# Altium project Pinger.PrjPcb
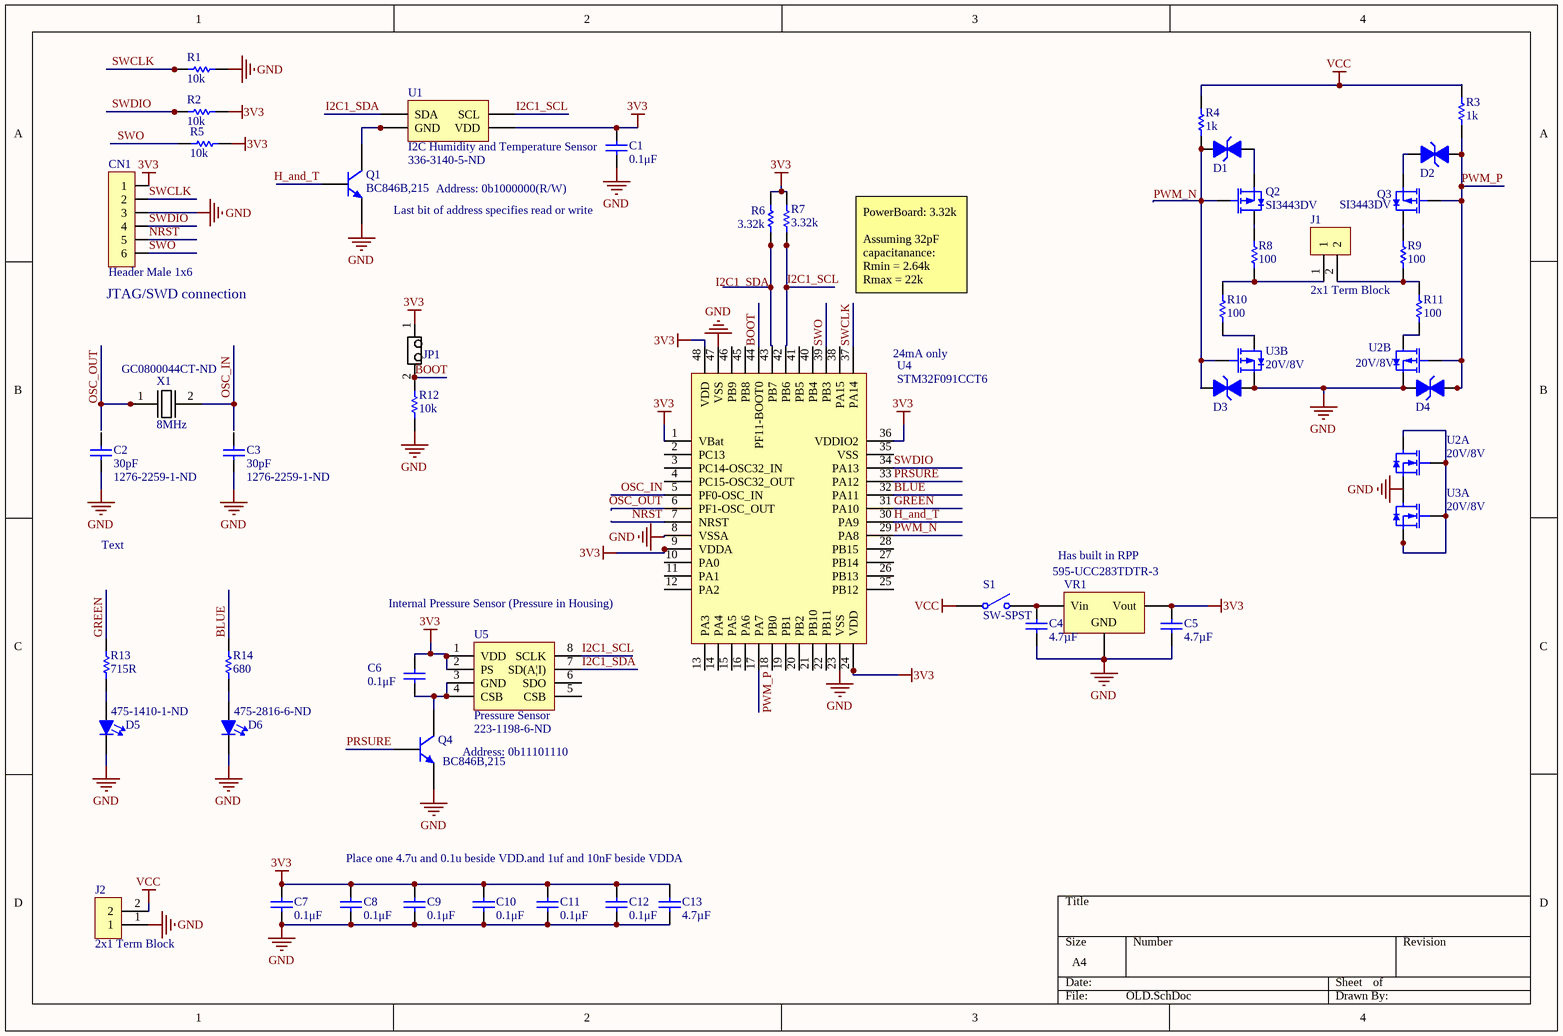
[diagram p0: OLD.SchDoc]
2 sheets, 106 parts. Net scope: global (net labels, ports and power ports of the same name join across sheets).
Board file: OLD.PcbDoc
Sheets:
  OLD.SchDoc
  main.SchDoc

## Sheet OLD.SchDoc: Pinger
size A4; Date: 05/06/2020; CompanyName: AUVIC; DrawnBy: Aman Nijjar; Engineer: Aman Nijjar; Organization: AUVIC; DocumentNumber: 1; Revision: 3; SheetNumber: 1; SheetTotal: 1

### Parts
C1  0.1μF  [CAPC1608N(0603")]
C2  30pF  Supplier Part Number 1: 1276-2259-1-ND  [CAPC1608N(0603")]
C3  30pF  Supplier Part Number 1: 1276-2259-1-ND  [CAPC1608N(0603")]
C4  4.7µF  [CAPC2012N(0805")]
C5  4.7µF  [CAPC2012N(0805")]
C6  0.1μF  [CAPC1608N(0603")]
C7  0.1μF  [CAPC1608N(0603")]
C8  0.1μF  [CAPC1608N(0603")]
C9  0.1μF  [CAPC1608N(0603")]
C10  0.1μF  [CAPC1608N(0603")]
C11  0.1μF  [CAPC1608N(0603")]
C12  0.1μF  [CAPC1608N(0603")]
C13  4.7µF  [CAPC2012N(0805")]
CN1  Header Male 1x6  [Header, Male, 1X6]
D1  SMBJ24CA  [DO-214AC]  (value not drawn)
D2  SMBJ24CA  [DO-214AC]  (value not drawn)
D3  SMBJ24CA  [DO-214AC]  (value not drawn)
D4  SMBJ24CA  [DO-214AC]  (value not drawn)
D5  Supplier Part Number 1: 475-1410-1-ND  [LED0805]  (hidden comment: Red)
D6  Supplier Part Number 1: 475-2816-6-ND  [LED0603]  (hidden comment: Blue)
J1  2x1 Term Block  [2X1 Terminal Blocks Phoenix Contact 5mm]
J2  2x1 Term Block  [2X1 Terminal Blocks]
JP1  1X2 Pin Head  [2X1 Males Header]  (value not drawn)
Q1  BC846B,215  [SOT-23]
Q2  SI3443DV  [SuperSOT-6]
Q3  SI3443DV  [SuperSOT-6]
Q4  BC846B,215  [SOT-23]
R1  10k  [RESC1608N(0603")]
R2  10k  [RESC1608N(0603")]
R3  1k  [RESC1608N(0603")]
R4  1k  [RESC1608N(0603")]
R5  10k  [RESC1608N(0603")]
R6  3.32k  [RESC1608N(0603")]
R7  3.32k  [RESC1608N(0603")]
R8  100  [RESC1608N(0603")]
R9  100  [RESC1608N(0603")]
R10  100  [RESC1608N(0603")]
R11  100  [RESC1608N(0603")]
R12  10k  [RESC1608N(0603")]
R13  715R  [RESC1608N(0603")]
R14  680  [RESC2012N(0805")]
S1  SW-SPST  [SPST-2]
U1  I2C Humidity and Temperature Sensor  Supplier Part Number 1: 336-3140-5-ND  [QFN-6]
U2  20V/8V  [SOT-363]  (parts A,B of 2)
U3  20V/8V  [SOT-363]  (parts A,B of 2)
U4  STM32F091CCT6  [STM-48LQFP]
U5  Pressure Sensor  Supplier Part Number 1: 223-1198-6-ND  [TE Pressure Sensor (MS560702BA03-50)]
VR1  595-UCC283TDTR-3  [D2PAK_N]
X1  8MHz  Supplier Part Number 1: GC0800044CT-ND  [HC49/US]

### Nets
3V3: C1.1(Anode) C1.2(Cathode) C2.1 C3.1 C4.1(Anode) C5.1(Anode) C5.2(Cathode) C6.2(Cathode) C7.1(Anode) C7.2(Cathode) C8.1(Anode) C8.2(Cathode) C9.1(Anode) C9.2(Cathode) C10.1(Anode) C10.2(Cathode) C11.1(Anode) C11.2(Cathode) C12.1(Anode) C12.2(Cathode) C13.1(Anode) C13.2(Cathode) CN1.1 CN1.3 D3.2(Cathode) D4.2(Cathode) D5.1(Cathode) D6.1(Cathode) J2.1 JP1.1 Q1.2(E) Q4.2(E) R1.1 R2.2 R5.2 R6.1 R7.1 R12.1 U1.5(VDD) U2.4(S2) U3.4(S2) U3.6(D1) U4.1(VBat) U4.8(VSSA) U4.9(VDDA) U4.23(VSS) U4.24(VDD) U4.36(VDDIO2) U4.47(VSS) U4.48(VDD) U5.1(VDD) U5.2(PS) VR1.2(GND) VR1.3(Vout)  [also labelled GND]
VCC: J2.2 R3.2 R4.2 S1.1(COMMON)
BLUE: R14.2 U4.32(PA11)
BOOT: JP1.2 R12.2 U4.44(PF11-BOOT0)
GREEN: R13.2 U4.31(PA10)
H_and_T: Q1.1(B) U4.30(PA9)
I2C1_SCL: R7.2 U1.6(SCL) U4.42(PB6) U5.8(SCLK)
I2C1_SDA: R6.2 U1.1(SDA) U4.43(PB7) U5.7(SD(A|I))
NRST: CN1.5 U4.7(NRST)
OSC_IN: U4.5(PF0-OSC_IN) X1.2
OSC_OUT: U4.6(PF1-OSC_OUT) X1.1
PRSURE: Q4.1(B) U4.33(PA12)
PWM_N: D1.2(Cathode) D3.1(Anode) Q2.3 R4.1 U3.5(G2) U4.29(PA8)
PWM_P: D2.2(Cathode) D4.1(Anode) Q3.3 R3.1 U2.5(G2) U4.17(PA7)
SWCLK: CN1.2 R1.2 U4.37(PA14)
SWDIO: CN1.4 R2.1 U4.34(PA13)
SWO: CN1.6 R5.1 U4.39(PB3)
NetC4_2: C4.2(Cathode) S1.2(NO) VR1.1(Vin)
NetC6_1: C6.1(Anode) Q4.3(C) U5.3(GND) U5.4(CSB)
NetD1_1: D1.1(Anode) Q2.1
NetD2_1: D2.1(Anode) Q3.1
NetD5_2: D5.2(Anode) R13.1
NetD6_2: D6.2(Anode) R14.1
NetJ1_1: J1.1 R8.1 R10.2
NetJ1_2: J1.2 R9.1 R11.2
NetQ1_3: Q1.3(C) U1.2(GND)
NetQ2_4: Q2.4 R8.2
NetQ3_4: Q3.4 R9.2
NetR10_1: R10.1 U3.3(D2)
NetR11_1: R11.1 U2.3(D2)
NetU2_2: U2.2(G1) U2.6(D1) U3.1(S1) U3.2(G1)

Not connected (* = marked no-connect by the designer): C2 2; C3 2; U2 1(S1); U4 2(PC13) 3(PC14-OSC32_IN) 4(PC15-OSC32_OUT) 10(PA0) 11(PA1) 12(PA2) 13(PA3) 14(PA4) 15(PA5) 16(PA6) 18(PB0) 19(PB1) 20(PB2) 21(PB10) 22(PB11) 25(PB12) 26(PB13) 27(PB14) 28(PB15) 35(VSS) 38(PA15) 40(PB4) 41(PB5) 45(PB8) 46(PB9); U5 5(CSB) 6(SDO)

### Notes on the sheet
- Last bit of address specifies read or write
- Address: 0b1000000(R/W)
- (near CN1) JTAG/SWD connection
- PowerBoard: 3.32k
  Assuming 32pF capacitanance:
  Rmin = 2.64k
  Rmax = 22k
- (near U4) 24mA only
- Text
- Has built in RPP
- (near U4) Internal Pressure Sensor (Pressure in Housing)
- (near Q4) Address: 0b11101110
- Place one 4.7u and 0.1u beside VDD.and 1uf and 10nF beside VDDA

### Library data of the parts
C1 C6-C12 = 0.1uF 100V 0603 SMD, Ceramic: Capacitor, Ceramic, 100V, +/- 10%, 0603 SMD, X7R; MFG: TDK; MFG#: CGA3E3X7S2A104K080AB; Published: 16-04-26; Publisher: AUVic; PackageDescription: Chip Capacitor; Value: 0.1μF; Created By: Ashwin Sira; Supplier 1: Digi-Key; Supplier Part Number 1: 445-6938-1-ND
C2 C3 = 30pF 50V 0603 SMD, Ceramic: Capacitor, Ceramic, 50V, +/-1%, 0603 SMD, C0G; Made By: Andy Bates; Published: 16-09-12; Publisher: AUVic; PackageDescription: Chip Capacitor; Value: 30pF; Supplier 1: Digi-Key
C4 C5 C13 = 4.7uF 35V 0805 SMD, Ceramic: Capacitor, Ceramic, 35V, +/- 10%, 0805 SMD, X5R; Made By: Andy Bates; Published: 16-11-12; Publisher: AUVic; PackageDescription: Chip Capacitor; Value: 4.7µF; Supplier 1: Digi-Key; Supplier Part Number 1: 1276-6722-1-ND
CN1 = Header, Male, 1x6: 1x6, Pads Pitch: 0.1" (2.54mm), Through hole; Made Bates: Andy Bates; Supplier 1: Digikey; Supplier 1 Part Number: 952-2270-ND
D1-D4 = SMBJ24CA: TVS DIODE 24VWM 38.9VC SMB; Manufacturer: Fairchild Semiconductor; Type: Zener; Bidirectional Channels: 1; Voltage - Reverse Standoff (Typ): 24V; Voltage - Breakdown (Min): 26.7V; Voltage - Clamping (Max) @ Ipp: 38.9V; Current - Peak Pulse (10/1000µs): 15.4A; Power - Peak Pulse: 600W; Power Line Protection: No; Supplier 1: Digi-Key; Manufacturer Part Number: SMBJ24CA; RoHS: RoHS Compliant; Category: Circuit Protection; Stock 1: 31873; Pricing 1: 1=0.58, 10=0.411, 25=0.3372, 100=0.2695, 250=0.19636, 500=0.15946, 1000=0.12257 (USD); Packaging: Cut Tape (CT); Unidirectional Channels: -; Applications: General Purpose; Capacitance @ Frequency: -; Operating Temperature: -55°C ~ 150°C (TJ); Mounting Type: Surface Mount; Package / Case: DO-214AA, SMB; Supplier Device Package: DO-214AA (SMB); ComponentLink1URL: http://www.fairchildsemi.com/datasheets/SM/SMBJ100A.pdf; ComponentLink1Description: http://www.fairchildsemi.com/datasheets/SM/SMBJ100A.pdf; Supplier Part Number 1: SMBJ24CAFSCT-ND
D5 = LED, 0805 (2012), Green, Clear: Colour: Red; Created By: Andy Bates; Supplier 1: Digi-Key
D6 = LED, 0603 (1608), Blue, Clear: Colour: Blue; Created By: Lyden Smith; Date Created: 2017-09-19; Supplier 1: Digi-Key
J1 = 2x1 Terminal Block, 20A, 12-20AWG: Made by: Andy Bates; Date Made: 2017-11-14; Supplier 1: Digi-Key; Supplier Part Number 1: 277-6405-ND
J2 = 2x1 Terminal Block: Made by: Andy Bates; Supplier 1: Digikey; Supplier Part Number 1: ED2740-ND
JP1 = 1x2 Male Header: Made By: Andy Bates; Supplier 1: Digikey; Supplier Part Number 1: 952-3073-ND
Q1 Q4 = BC846B,215: NPN 65V 100mA 250mW; Published: 8-Jun-2000; LatestRevisionDate: 09-Sep-2016; DatasheetVersion: 1997; Publisher: Andy Bates; Supplier 1: Digi-Key; Supplier Part Number 1: 568-1632-1-ND
Q2 Q3 = SI3443DVFSTR-ND: P-Channel 20V 4A (Ta) 1.6W (Ta) Surface Mount SuperSOT™-6; ComponentLink1Description: Datasheet; ComponentLink1URL: *https://www.onsemi.com/pub/Collateral/SI3443DV-D.PDF; Supplier 1: Digi-Key
R1 R2 R5 R12 = 10kR, 1%, 1/10W, 0603 SMD: Made By: Ashwin Sira; Owned By: AUVic; Created On: 14-05-31; Last Edited: 14-05-31; Supplier 1: Digi-Key; Supplier Part Number 1: 311-10.0KHRCT-ND; Value: 10k
R3 R4 = 1kR, 1%, 1/10W , 0603, SMD: Created By: Andy Bates; Publisher: AUVic; Date Created: 2017-05-10; Value: 1k; Supplier 1: Digikey; Supplier Part Number 1: 311-1.00KHRCT-ND
R6 R7 = 3.32k, 1%, 1/10W, 0603, SMD: Created By: Ashwin Sira; Publisher: AUVic; Date Created: 2016-06-25; Value: 3.32k; Supplier 1: Digi-Key; Supplier Part Number 1: RMCF0603FT3K32CT-ND
R8-R11 = 100R, 1%, 1/10W, 0603 SMD: Made By: Andy Bates; Owned By: AUVic; Created On: 16-09-10; Last Edited: 16-09-10; Value: 100; Supplier 1: Digi-Key; Supplier Part Number 1: 311-100HRCT-ND
R13 = 715R, 1%, 1/10W, 0603, SMD: Created By: Ashwin Sira; Publisher: AUVic; Date Created: 2016-06-10; Value: 715R; Supplier 1: Digi-Key; Supplier Part Number 1: 541-715HCT-ND
R14 = 680, 5%, 1/8W, 0805 SMD: Value: 680; Created By: Lyden Smith; Created On: 2017-06-04; Supplier 1: Digi-Key; Supplier Part Number 1: RMCF0805JT680RCT-ND
S1 = SW-SPST: Single-Pole, Single-Throw Switch; Published: 24-Mar-1999; LatestRevisionDate: 17-Jul-2002; LatestRevisionNote: Re-released for DXP Platform.; PackageReference: SPST-2; Publisher: Altium Limited; PackageDescription: Switch; 2 Leads
U1 = Si700XX: Made by: Andy Bates; Supplier 1: Digi-Key; Created on: 2019/09/08
U2 U3 = NTJD4105CT1GOSTR-ND: Mosfet Array N and P-Channel 20V, 8V 630mA, 775mA 270mW Surface Mount SC-88/SC70-6/SOT-363; Supplier 1: Digi-Key; Supplier Part Number 1: NTJD4105CT1GOSCT-ND; ComponentLink1Description: Datasheet; ComponentLink1URL: https://www.onsemi.com/pub/Collateral/NTJD4105C-D.PDF
U4 = STM32F091CCT6: LQFP48 Chip; Made by: Andy Bates; Digikey Number: 497-15166-ND; Supplier 1: Digikey
U5 = MS560702BA03-50 Pressure Sensor: 1kPa to 120 kPa; Made by: Andy Bates; Created on: 2017-09-11; Supplier 1: Digi-Key
VR1 = Volt Reg: Voltage Regulator; Published: 24-Mar-1999; LatestRevisionDate: 29-May-2009; LatestRevisionNote: IPC-7351 Footprint Added.; PackageReference: D2PAK; Publisher: Altium Limited; PackageDescription: 3-Pin Transistor Outline Package 2.54 mm Pitch, 15.1 mm Lead Span
X1 = Oscillator 8MHz 40ESR: 8Mhz 40ESR  16pF -20°C ~ 70°C; Made By: Lyden Smith; Date Made: 2017-09-18; Supplier 1: Digi-Key

## Sheet main.SchDoc
size A4
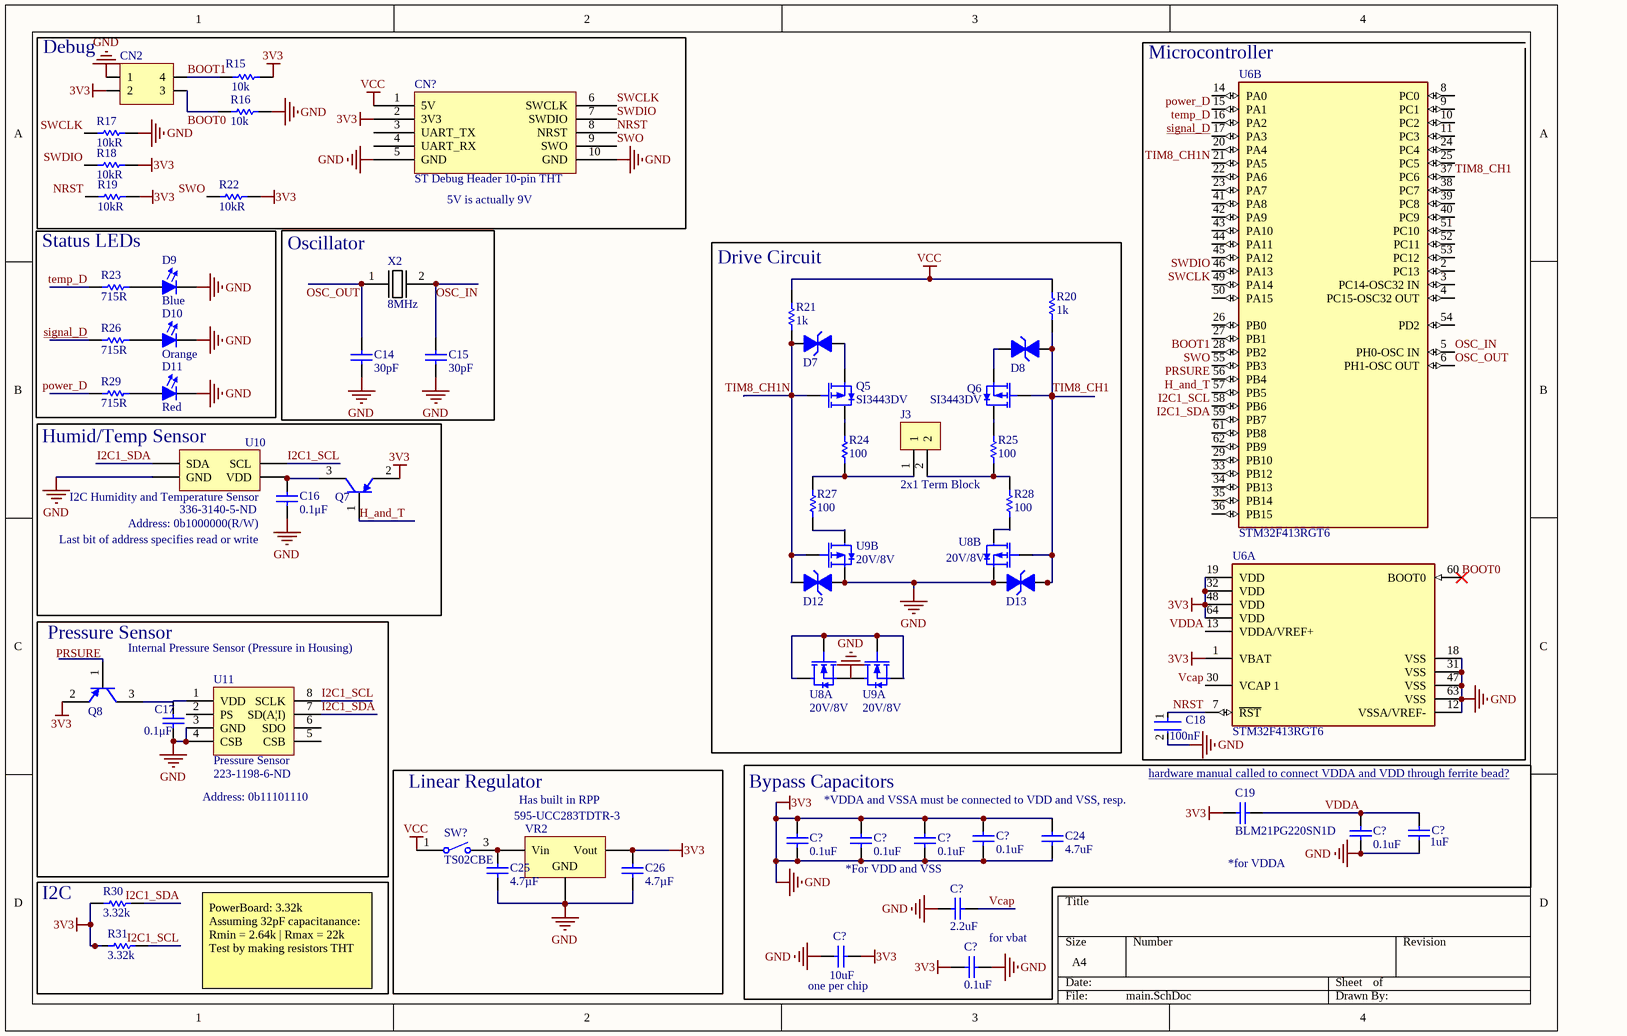
[diagram p1: main.SchDoc]

### Parts
(Parts that share a designator on the sheet are numbered #1, #2 ... from top to bottom, then left to right.)
C14  30pF  [CAPC1608N(0603")]
C15  30pF  [CAPC1608N(0603")]
C16  0.1μF  [CAPC1608N(0603")]
C17  0.1μF  [CAPC1608N(0603")]
C18  Capacitance: 100nF  [FP-CL10-0_1-MFG]  (hidden comment: CL10B104JB8NNNC)
C19  BLM21PG220SN1D  [CAPC2013X105X50ML20T20]
C24  4.7uF  [CAPC1608N(0603")]
C25  4.7µF  [CAPC2012N(0805")]
C26  4.7µF  [CAPC2012N(0805")]
C?#1  Capacitance: 0.1uF  [FP-CL10-0_1-MFG]  (hidden comment: CL10B104JB8NNNC)
C?#2  Capacitance: 1uF  [0803 CAP]  (hidden comment: CL21B105KBFNNNG)
C?#3  Capacitance: 0.1uF  [FP-CL10-0_1-MFG]  (hidden comment: CL10B104JB8NNNC)
C?#4  Capacitance: 0.1uF  [FP-CL10-0_1-MFG]  (hidden comment: CL10B104JB8NNNC)
C?#5  Capacitance: 0.1uF  [FP-CL10-0_1-MFG]  (hidden comment: CL10B104JB8NNNC)
C?#6  Capacitance: 0.1uF  [FP-CL10-0_1-MFG]  (hidden comment: CL10B104JB8NNNC)
C?#7  2.2uF  [CAPC1608N(0603")]
C?#8  Capacitance: 10uF  [CAPC3216X180X50LL20T30]  (hidden comment: CL31B106KBHNNNE)
C?#9  Capacitance: 0.1uF  [FP-CL10-0_1-MFG]  (hidden comment: CL10B104JB8NNNC)
CN2  Header, Male, 2x2, Pitch: 0.1" (2.54mm), THT  [Header, Male, 2x2, Pitch: 0.1" (2.54mm),THT]  (value not drawn)
CN?  ST Debug Header 10-pin THT  [10-pin shrouded header THT]
D7  SMBJ24CA  [DO-214AC]  (value not drawn)
D8  SMBJ24CA  [DO-214AC]  (value not drawn)
D9  Blue  [LED0805]
D10  Orange  [LED0805]
D11  Red  [LED0805]
D12  SMBJ24CA  [DO-214AC]  (value not drawn)
D13  SMBJ24CA  [DO-214AC]  (value not drawn)
J3  2x1 Term Block  [2X1 Terminal Blocks Phoenix Contact 5mm]
Q5  SI3443DV  [SuperSOT-6]
Q6  SI3443DV  [SuperSOT-6]
Q7  MMBT3906LT3G  [ONSC-SOT-23-3-318-08_V]  (value not drawn)
Q8  MMBT3906LT3G  [ONSC-SOT-23-3-318-08_V]  (value not drawn)
R15  10k  [RESC1608N(0603")]
R16  10k  [RESC1608N(0603")]
R17  10kR  [RESC1608N(0603")]
R18  10kR  [RESC1608N(0603")]
R19  10kR  [RESC1608N(0603")]
R20  1k  [RESC1608N(0603")]
R21  1k  [RESC1608N(0603")]
R22  10kR  [RESC1608N(0603")]
R23  715R  [RESC1608N(0603")]
R24  100  [RESC1608N(0603")]
R25  100  [RESC1608N(0603")]
R26  715R  [RESC1608N(0603")]
R27  100  [RESC1608N(0603")]
R28  100  [RESC1608N(0603")]
R29  715R  [RESC1608N(0603")]
R30  3.32k  [RESC1608N(0603")]
R31  3.32k  [RESC1608N(0603")]
SW?  TS02CBE  [CKCP-TS02CBE_V]
U6  STM32F413RGT6  [FP-LQFP64-5W-MFG]  (parts A,B of 2)
U8  20V/8V  [SOT-363]  (parts A,B of 2)
U9  20V/8V  [SOT-363]  (parts A,B of 2)
U10  I2C Humidity and Temperature Sensor  Supplier Part Number 1: 336-3140-5-ND  [QFN-6]
U11  Pressure Sensor  Supplier Part Number 1: 223-1198-6-ND  [TE Pressure Sensor (MS560702BA03-50)]
VR2  595-UCC283TDTR-3  [D2PAK_N]
X2  8MHz  [HC49/US]

### Blocks framed on the sheet
Debug: CN2 CN? R15-R19 R22
Status LEDs: D9-D11 R23 R26 R29
Oscillator: C14 C15 X2
Drive Circuit: D7 D8 D12 D13 J3 Q5 Q6 R20 R21 R24 R25 R27 R28 U8 U9
Humid/Temp Sensor: C16 Q7 U10
Pressure Sensor: C17 Q8 U11
Linear Regulator: C25 C26 SW? VR2
Bypass Capacitors: C19 C24 C?#1-C?#9
I2C: R30 R31

### Nets
3V3: C14.1 C15.1 C16.1(Anode) C17.1(Anode) C18.2 C19.1 C24.1(Anode) C24.2(Cathode) C25.1(Anode) C26.1(Anode) C26.2(Cathode) C?#1.1 C?#1.2 C?#2.1 C?#3.1 C?#4.1 C?#4.2 C?#5.1 C?#6.1 C?#6.2 C?#7.1(Anode) C?#8.1 C?#8.2 C?#9.1 C?#9.2 CN2.1 CN2.2 CN?.2(3V3) CN?.5(GND) CN?.10(GND) D9.1(Cathode) D10.1(Cathode) D11.1(Cathode) D12.2(Cathode) D13.2(Cathode) Q7.2(E) Q8.2(E) R15.1 R16.1 R17.2 R18.2 R19.2 R22.2 R30.1 R31.1 U6.1(VBAT) U6.12(VSSA/VREF-) U6.18(VSS) U6.19(VDD) U6.31(VSS) U6.32(VDD) U6.47(VSS) U6.48(VDD) U6.63(VSS) U6.64(VDD) U8.1(S1) U8.4(S2) U9.4(S2) U10.2(GND) U11.3(GND) U11.4(CSB) VR2.2(GND) VR2.3(Vout)  [also labelled GND]
VCC: CN?.1(5V) R20.2 R21.2 SW?.1
BOOT0: CN2.3 R16.2 U6.60(BOOT0)
BOOT1: CN2.4 R15.2 U6.28(PB2)
H_and_T: Q7.1(B) U6.57(PB5)
I2C1_SCL: R31.2 U6.58(PB6) U10.6(SCL) U11.8(SCLK)
I2C1_SDA: R30.2 U6.59(PB7) U10.1(SDA) U11.7(SD(A|I))
NRST: C18.1 CN?.8(NRST) R19.1 U6.7(~{RST})
OSC_IN: C15.2 U6.5(PH0-OSC_IN) X2.2
OSC_OUT: C14.2 U6.6(PH1-OSC_OUT) X2.1
power_D: R29.1 U6.15(PA1)
PRSURE: Q8.1(B) U6.56(PB4)
signal_D: R26.1 U6.17(PA3)
SWCLK: CN?.6(SWCLK) R17.1 U6.49(PA14)
SWDIO: CN?.7(SWDIO) R18.1 U6.46(PA13)
SWO: CN?.9(SWO) R22.1 U6.55(PB3)
temp_D: R23.1 U6.16(PA2)
TIM8_CH1: D8.2(Cathode) D13.1(Anode) Q6.3 R20.1 U6.37(PC6) U8.5(G2)
TIM8_CH1N: D7.2(Cathode) D12.1(Anode) Q5.3 R21.1 U6.21(PA5) U9.5(G2)
Vcap: C?#7.2(Cathode) U6.30(VCAP_1)
VDDA: C19.2 C?#2.2 C?#3.2 U6.13(VDDA/VREF+)
NetC16_2: C16.2(Cathode) Q7.3(C) U10.5(VDD)
NetC17_2: C17.2(Cathode) Q8.3(C) U11.1(VDD)
NetC25_2: C25.2(Cathode) SW?.3 VR2.1(Vin)
NetD7_1: D7.1(Anode) Q5.1
NetD8_1: D8.1(Anode) Q6.1
NetD9_2: D9.2(Anode) R23.2
NetD10_2: D10.2(Anode) R26.2
NetD11_2: D11.2(Anode) R29.2
NetJ3_1: J3.1 R24.1 R27.2
NetJ3_2: J3.2 R25.1 R28.2
NetQ5_4: Q5.4 R24.2
NetQ6_4: Q6.4 R25.2
NetR27_1: R27.1 U9.3(D2)
NetR28_1: R28.1 U8.3(D2)
NetU8_2: U8.2(G1) U8.6(D1) U9.1(S1) U9.2(G1)

Not connected (* = marked no-connect by the designer): C?#5 2; CN? 3(UART_TX) 4(UART_RX); U6 2(PC13) 3(PC14-OSC32_IN) 4(PC15-OSC32_OUT) 8(PC0) 9(PC1) 10(PC2) 11(PC3) 14(PA0) 20(PA4) 22(PA6) 23(PA7) 24(PC4) 25(PC5) 26(PB0) 27(PB1) 29(PB10) 33(PB12) 34(PB13) 35(PB14) 36(PB15) 38(PC7) 39(PC8) 40(PC9) 41(PA8) 42(PA9) 43(PA10) 44(PA11) 45(PA12) 50(PA15) 51(PC10) 52(PC11) 53(PC12) 54(PD2) 61(PB8) 62(PB9); U9 6(D1); U11 2(PS) 5(CSB) 6(SDO)

### Notes on the sheet
- (near U6) Microcontroller
- (near CN?) 5V is actually 9V
- (near C16) Last bit of address specifies read or write
- (near C16) Address: 0b1000000(R/W)
- Internal Pressure Sensor (Pressure in Housing)
- hardware manual called to connect VDDA and VDD through ferrite bead? <https://www.st.com/resource/en/application_note/dm00115714-getting-started-with-stm32f4xxxx-mcu-hardware-development-stmicroelectronics.pdf>
- Address: 0b11101110
- Has built in RPP
- *VDDA and VSSA must be connected to VDD and VSS, resp.
- (near C?#4) *For VDD and VSS
- (near C19) *for VDDA
- PowerBoard: 3.32k
  Assuming 32pF capacitanance:
  Rmin = 2.64k | Rmax = 22k
  Test by making resistors THT
- (near C?#8) one per chip
- (near C?#9) for vbat

### Library data of the parts
C14 C15 = CMP-006-0040-1: Capacitor, Ceramic, 50V, +/-1%, 0603 SMD, C0G; Made By: Andy Bates; Design Item ID: 30pF 50V 0603 SMD, Ceramic; Value: 30pF; PackageDescription: Chip Capacitor; Source: AUVic_Schematic_Library_Capacitors.SchLib; Publisher: AUVic; Pin Count: 2; Published: 16-09-12; Component Type: Standard
C16 C17 = 0.1uF 100V 0603 SMD, Ceramic: as C1 on sheet OLD; Published: 16-04-26; Publisher: AUVic; PackageDescription: Chip Capacitor; Value: 0.1μF; Created By: Ashwin Sira; Supplier 1: Digi-Key; Supplier Part Number 1: 445-6938-1-ND
C18 = CMP-00000-1: CAP CER 0.1UF 50V X7R 0603; Material: Ceramic; Tolerance: 5%; Dielectric: X7R; Width: 0.031inch; Min Operating Temperature: -55°C; Contact Plating: Tin; Length: 1.6mm; Case/Package: 0603; Package Quantity: 1; Voltage Rating: 50V; Radiation Hardening: No; Packaging: Tape and Reel; Max Operating Temperature: 125°C; Case Code (Imperial): 0603; Thickness: 0.035inch; Case Code (Metric): 1608; Height: 0.8mm; Mount: Surface Mount; Depth: 0.8mm
C19 = CMP-2007-03669-1: Manufacturer: Murata; Part Number: BLM21PG220SN1D
C24 = CMP-006-0043-1: Capacitor, Ceramic, 10V, +/- 10%, 0603 SMD, X5R; Value: 4.7µF; MFG: Samsung; MFG#: GRM188R61A475KE15D; PackageDescription: Chip Capacitor; Source: AUVic_Schematic_Library_Capacitors.SchLib; Published: 16-06-23; Created By: Ashwin Sira; Component Type: Standard; Pin Count: 2; Publisher: AUVic; Design Item ID: 4.7uF 10V 0603 SMD, Ceramic
C25 C26 = 4.7uF 35V 0805 SMD, Ceramic: as C4 on sheet OLD; Published: 16-11-12; Publisher: AUVic; PackageDescription: Chip Capacitor; Value: 4.7µF; Supplier 1: Digi-Key; Supplier Part Number 1: 1276-6722-1-ND
C?#1 C?#3-C?#6 C?#9 = CMP-00000-3: CAP CER 0.1UF 50V X7R 0603; Tolerance: 5%; Material: Ceramic; Case Code (Imperial): 0603; Mount: Surface Mount; Thickness: 0.035inch; Depth: 0.8mm; Packaging: Tape and Reel; Package Quantity: 1; Dielectric: X7R; Height: 0.8mm; Voltage: 50V; Radiation Hardening: No; Max Operating Temperature: 125°C; Voltage Rating: 50V; Case/Package: 0603; Min Operating Temperature: -55°C; Case Code (Metric): 1608; Length: 1.6mm; Contact Plating: Tin; Width: 0.031inch
C?#2 = CMP-00005-1: SAMSUNG ELECTRO-MECHANICS - CL21B105KBFNNNG - MLCC CAPACITORS; Tolerance: 10%; Voltage Rating: 50V; Material: Ceramic; Dielectric: X7R; Case/Package: 0805; Contact Plating: Tin; Max Operating Temperature: 125°C; Termination: Wraparound; Package Quantity: 3000; Depth: 1.25mm; Mount: Surface Mount; Min Operating Temperature: -55°C; Thickness: 0.053inch; Packaging: Tape and Reel; Case Code (Metric): 2012; Length: 2mm; Case Code (Imperial): 0805; Width: 0.049inch
C?#7 = CMP-006-0030-1: Capacitor, Ceramic, 50V, 10%, 0603 SMD, X5R; Value: 2.2µF; Date Created: *; Design Item ID: 2.2uF, 50V, 0603 SMD, X5R, Ceramic; Made By: *; Publisher: AUVic; Source: AUVic_Schematic_Library_Capacitors.SchLib; Pin Count: 2; PackageDescription: Chip Capacitor; Component Type: Standard
C?#8 = CMP-00004-1: Cap Ceramic 10uF 50V X7R 10% Pad SMD 1206 125°C T/R; Thickness: 0.071inch; Case/Package: 1206; Case Code (Metric): 3216; Case Code (Imperial): 1206; Voltage Rating: 50V; Length: 0.126inch; Max Operating Temperature: 125°C; Voltage Rating (DC): 50V; Dielectric: X7R; Lead Free: Lead Free; Min Operating Temperature: -55°C; Tolerance: 10%; Mount: Surface Mount; Packaging: Tape and Reel; Width: 0.063inch
CN2 = CMP-005-0036-1: Pin Count: 4; Date Published: 2018-01-27; Last Updated: *; Source: AUVic_Schematic_Library_Connectors.SchLib; Design Item ID: Header, Male, 2x2, Pitch: 0.1" (2.54mm), THT; Publisher: AUVic; Reviewed By: *; Created By: Lyden Smith; Component Type: Standard
CN? = CMP-00011-5: CONN HEADER VERT 10POS 2.54MM; Row Spacing: 0.1inch; Connector Type: Male Pin; Number of Positions: 10; Packaging: Tray; Package Quantity: 1; Color: Black; Number of Rows: 2; Termination: Solder; Contact Plating: Gold; Lead Free: Lead Free; Pitch: 0.1inch; Mount: Through Hole
D7 D8 D12 D13 = SMBJ24CA: as D1 on sheet OLD; Supplier 1: Digi-Key; Manufacturer Part Number: SMBJ24CA; RoHS: RoHS Compliant; Category: Circuit Protection; Stock 1: 31873; Pricing 1: 1=0.58, 10=0.411, 25=0.3372, 100=0.2695, 250=0.19636, 500=0.15946, 1000=0.12257 (USD); Packaging: Cut Tape (CT); Unidirectional Channels: -; Applications: General Purpose; Capacitance @ Frequency: -; Operating Temperature: -55°C ~ 150°C (TJ); Mounting Type: Surface Mount; Package / Case: DO-214AA, SMB; Supplier Device Package: DO-214AA (SMB); ComponentLink1URL: http://www.fairchildsemi.com/datasheets/SM/SMBJ100A.pdf; ComponentLink1Description: http://www.fairchildsemi.com/datasheets/SM/SMBJ100A.pdf; Supplier Part Number 1: SMBJ24CAFSCT-ND
D9 = CMP-057-0008-1: LED, 0805 (2012), Blue, Clear; Colour: Red; Design Item ID: LED, 0805 (2012), Blue, Clear; Component Type: Standard; Pin Count: 2; Source: AUVic_Schematic_Library_Diodes.SchLib; Created By: Ashwin Sira
D10 = CMP-057-0010-1: LED, 0805 (2012), Orange, Clear; Pin Count: 2; Source: AUVic_Schematic_Library_Diodes.SchLib; Component Type: Standard; ComponentLink1Description: Digikey; Colour: Orange; ComponentLink1URL: https://www.digikey.ca/product-detail/en/lite-on-inc/LTST-C170KFKT/160-1413-1-ND/386774; Created By: Robert Keen; Design Item ID: LED, 0805 (2012), Orange, Clear
D11 = CMP-057-0011-1: LED, 0805 (2012), Red, Clear; Design Item ID: LED, 0805 (2012), Red, Clear; Colour: Red; Component Type: Standard; Pin Count: 2; Created By: Ashwin Sira; Source: AUVic_Schematic_Library_Diodes.SchLib
J3 = 2x1 Terminal Block, 20A, 12-20AWG: Made by: Andy Bates; Date Made: 2017-11-14; Supplier 1: Digi-Key; Supplier Part Number 1: 277-6405-ND
Q5 Q6 = SI3443DVFSTR-ND: as Q2 on sheet OLD; ComponentLink1Description: Datasheet; ComponentLink1URL: *https://www.onsemi.com/pub/Collateral/SI3443DV-D.PDF; Supplier 1: Digi-Key
Q7 Q8 = CMP-1048-00645-1: General Purpose Transistor, PNP Silicon, 3-Pin SOT-23, Pb-Free, Tape and Reel; Manufacturer: On Semiconductor; fT Min (MHz): 250; IC Continuous (A): -0.2; ComponentLink1URL: http://www.onsemi.com/; ComponentLink2Description: Datasheet; Packing: Tape and Reel; Polarity: PNP; PackageDescription: 3-Pin Small Outline Transistor, Body 2.92 x 1.3 mm, Pitch 0.95 mm; PackageVersion: Rev. AP, 11/2009; ComponentLink1Description: Manufacturer URL; ComponentLink3Description: Package Specification; PackageReference: SOT-23-3-318-08; PartNumber: MMBT3906LT3G; ComponentLink2URL: http://www.onsemi.cn/pub_link/Collateral/MMBT3906LT1-D.PDF; DatasheetVersion: Rev. 11; RoHS: TRUE; ComponentLink3URL: http://www.onsemi.cn/pub_link/Collateral/318-08.PDF; Mounting Technology: Surface Mount
R15 R16 = 10kR, 1%, 1/10W, 0603 SMD: Made By: Ashwin Sira; Owned By: AUVic; Created On: 14-05-31; Last Edited: 14-05-31; Supplier 1: Digi-Key; Supplier Part Number 1: 311-10.0KHRCT-ND; Value: 10k
R17-R19 R22 = CMP-047-0013-1: 10kR, 1%, 1/10W, 0603 SMD; Owned By: AUVic; Made By: Ashwin Sira; Value: 10k; Design Item ID: 10kR, 1%, 1/10W, 0603 SMD; Pin Count: 2; Component Type: Standard; Created On: 14-05-31; Last Edited: 14-05-31; Source: AUVic_Schematic_Library_Resistors.SchLib
R20 R21 = 1kR, 1%, 1/10W , 0603, SMD: Created By: Andy Bates; Publisher: AUVic; Date Created: 2017-05-10; Value: 1k; Supplier 1: Digikey; Supplier Part Number 1: 311-1.00KHRCT-ND
R23 R26 R29 = CMP-047-0066-1: 715R, 1%, 1/10W, 0603, SMD; Design Item ID: 715R, 1%, 1/10W, 0603, SMD; Source: AUVic_Schematic_Library_Resistors.SchLib; Value: 715R; Publisher: AUVic; Created By: Ashwin Sira; Pin Count: 2; Component Type: Standard; Date Created: 2016-06-10
R24 R25 R27 R28 = 100R, 1%, 1/10W, 0603 SMD: Made By: Andy Bates; Owned By: AUVic; Created On: 16-09-10; Last Edited: 16-09-10; Value: 100; Supplier 1: Digi-Key; Supplier Part Number 1: 311-100HRCT-ND
R30 R31 = 3.32k, 1%, 1/10W, 0603, SMD: Created By: Ashwin Sira; Publisher: AUVic; Date Created: 2016-06-25; Value: 3.32k; Supplier 1: Digi-Key; Supplier Part Number 1: RMCF0603FT3K32CT-ND
SW? = CMP-2000-07317-1: Tiny Slide Switch, SPST, 20 V, -30 to 85 degC, 2-Pin THD, RoHS, Bulk; Manufacturer: C&K Components; Product Height (mm): 12.91mm; Actuator Style: TopSlide; Product Length (mm): 10.16mm; Switch Configuration: OFFNoneON; AC Voltage Rating (Max): 20V; Product Depth (mm): 5.08mm; Actuator Material: Nylon; Mounting Technology: ThroughHole; Manufacturer URL: http://www.ckswitches.com/; Type: Tiny; Pole Throw Configuration: SPST; Terminal Type: PCPins; Package Reference: TS02CBE; Package Description: 2-Pin Through Hole Device, Body 10.16 x 5.08 mm; Datasheet Version: 02/2016; Datasheet URL: http://www.ck-components.com/media/1426/ts_12feb16.pdf; Contact Material: CopperAlloy; Housing Material: N/A/StainlessSteel; Operating Temp Range: -30Cto85C; Contact Plating: Gold/Nickel; DC Voltage Rating (Max): 20V; Mounting Style: ThroughHole
U6 = CMP-00006-1: STMICROELECTRONICS - STM32F413RGT6 - MCU, ARM CORTEX-M4, 100MHZ, LQFP-64; Number of I/Os: 50; Oscillator Type: Internal; Peripherals: Brown-out Detect/Reset,POR,PWM,WDT,DMA,LCD; Interface: I2C,SPI,USB,IrDA,MMC,SDIO,UART,USART; Memory Type: FLASH; Memory Size: 1MB; Case/Package: LQFP; Packaging: Tray; Core Architecture: ARM; Min Operating Temperature: -40°C; Max Operating Temperature: 85°C; Frequency: 100MHz
U8 U9 = NTJD4105CT1GOSTR-ND: as U2 on sheet OLD; Supplier 1: Digi-Key; Supplier Part Number 1: NTJD4105CT1GOSCT-ND; ComponentLink1Description: Datasheet; ComponentLink1URL: https://www.onsemi.com/pub/Collateral/NTJD4105C-D.PDF
U10 = Si700XX: Made by: Andy Bates; Supplier 1: Digi-Key; Created on: 2019/09/08
U11 = MS560702BA03-50 Pressure Sensor: 1kPa to 120 kPa; Made by: Andy Bates; Created on: 2017-09-11; Supplier 1: Digi-Key
VR2 = Volt Reg: Voltage Regulator; Published: 24-Mar-1999; LatestRevisionDate: 29-May-2009; LatestRevisionNote: IPC-7351 Footprint Added.; PackageReference: D2PAK; Publisher: Altium Limited; PackageDescription: 3-Pin Transistor Outline Package 2.54 mm Pitch, 15.1 mm Lead Span
X2 = CMP-043-0007-1: 8Mhz 40ESR  16pF -20°C ~ 70°C; Made By: Lyden Smith; Component Type: Standard; Source: AUVic_Schematic_Library_Oscillators.SchLib; Date Made: 2017-09-18; Pin Count: 2; Design Item ID: Oscillator 8MHz 40ESR

## Nets that join several sheets
3V3: OLD (54 pins), main (63 pins)
VCC: OLD (J2.2 R3.2 R4.2 S1.1), main (CN?.1 R20.2 R21.2 SW?.1)
H_and_T: OLD (Q1.1 U4.30), main (Q7.1 U6.57)
I2C1_SCL: OLD (R7.2 U1.6 U4.42 U5.8), main (R31.2 U6.58 U10.6 U11.8)
I2C1_SDA: OLD (R6.2 U1.1 U4.43 U5.7), main (R30.2 U6.59 U10.1 U11.7)
NRST: OLD (CN1.5 U4.7), main (C18.1 CN?.8 R19.1 U6.7)
OSC_IN: OLD (U4.5 X1.2), main (C15.2 U6.5 X2.2)
OSC_OUT: OLD (U4.6 X1.1), main (C14.2 U6.6 X2.1)
PRSURE: OLD (Q4.1 U4.33), main (Q8.1 U6.56)
SWCLK: OLD (CN1.2 R1.2 U4.37), main (CN?.6 R17.1 U6.49)
SWDIO: OLD (CN1.4 R2.1 U4.34), main (CN?.7 R18.1 U6.46)
SWO: OLD (CN1.6 R5.1 U4.39), main (CN?.9 R22.1 U6.55)